# Altium schematic sheet alphanumeric.SchDoc
size A4
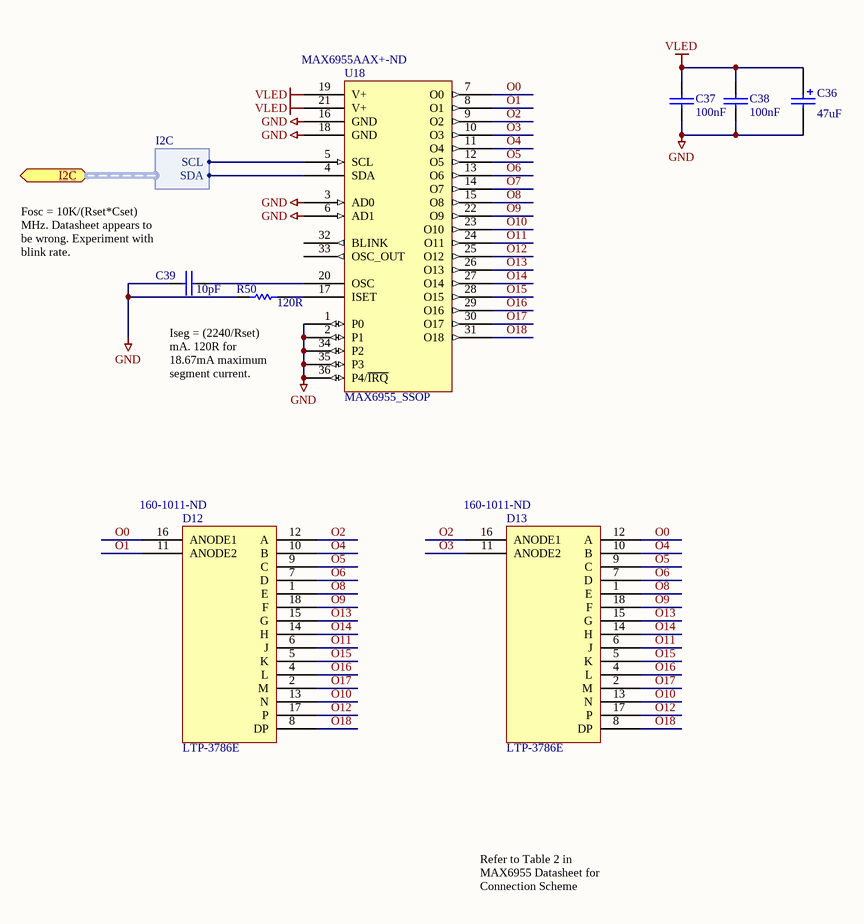
[diagram p0: alphanumeric.SchDoc]

## Parts
C36  value 47uF  [CAPMP7343X19N (Murata D4)]
C37  100nF  [0603]
C38  100nF  [0603]
C39  10pF  [0603]
D12  LTP-3786E  Supplier Part Number 1: 160-1011-ND  [LTP-3786E]
D13  LTP-3786E  Supplier Part Number 1: 160-1011-ND  [LTP-3786E]
R50  120R  [0603]
U18  MAX6955_SSOP  Supplier Part Number 1: MAX6955AAX+-ND  [SOP127P600-8N-36]

## Ports
I2C (harness I2C)

## Harnesses
I2C: SCL, SDA

## Nets
GND: C36.2 C37.1 C38.2 C39.1 R50.2 U18.1(P0) U18.2(P1) U18.3(AD0) U18.6(AD1) U18.16(GND) U18.18(GND) U18.34(P2) U18.35(P3) U18.36(P4/~{IRQ})
VLED: C36.1 C37.2 C38.1 U18.19(V+) U18.21(V+)
O0: D12.16(ANODE1) D13.12(A) U18.7(O0)
O1: D12.11(ANODE2) U18.8(O1)
O2: D12.12(A) D13.16(ANODE1) U18.9(O2)
O3: D13.11(ANODE2) U18.10(O3)
O4: D12.10(B) D13.10(B) U18.11(O4)
O5: D12.9(C) D13.9(C) U18.12(O5)
O6: D12.7(D) D13.7(D) U18.13(O6)
O7: U18.14(O7)
O8: D12.1(E) D13.1(E) U18.15(O8)
O9: D12.18(F) D13.18(F) U18.22(O9)
O10: D12.13(N) D13.13(N) U18.23(O10)
O11: D12.6(J) D13.6(J) U18.24(O11)
O12: D12.17(P) D13.17(P) U18.25(O12)
O13: D12.15(G) D13.15(G) U18.26(O13)
O14: D12.14(H) D13.14(H) U18.27(O14)
O15: D12.5(K) D13.5(K) U18.28(O15)
O16: D12.4(L) D13.4(L) U18.29(O16)
O17: D12.2(M) D13.2(M) U18.30(O17)
O18: D12.8(DP) D13.8(DP) U18.31(O18)
NetC39_2: C39.2 U18.20(OSC)
NetR50_1: R50.1 U18.17(ISET)
NetU18_4: U18.4(SDA) ; port I2C.SDA
NetU18_5: U18.5(SCL) ; port I2C.SCL

Not connected (* = marked no-connect by the designer): U18 32(BLINK) 33(OSC_OUT)

## Notes on the sheet
- (near C39) Fosc = 10K/(Rset*Cset) MHz. Datasheet appears to be wrong. Experiment with blink rate.
- Iseg = (2240/Rset) mA. 120R for 18.67mA maximum segment current.
- Refer to Table 2 in MAX6955 Datasheet for Connection Scheme

## Library data of the parts
C36 = CAP POL3: Polarized Capacitor (Surface Mount); Manufacturer: Generic Components; Manufacturer Part Number: ECASD40J476M025K00; Class I: Passive; Description: CAP ALUM 47UF 6.3V 20% SMD; Capacitance: 47µF; Voltage Rating: 6.3V; Tolerance: ±20%; ESR (Equivalent Series Resistance): 25 mOhm; Lifetime @ Temp.: 1000 Hrs @ 105°C; Type: Polymer; Ripple Current: 1.8A; Surface Mount Land Size: 0.287" L x 0.169" W (7.30mm x 4.30mm); Published: 8-Jun-2000; Revision: July-2002: Re-released for DXP Platform.; Publisher: Altium Limited; Class II: Capacitor; Digikey: 490-5463-1-ND; Supplier 1: Digi-Key; Supplier Part Number 1: 490-5463-1-ND; RoHS: RoHS Compliant; Category: Capacitors; Stock 1: 3903; Pricing 1: 1=2.26, 10=1.848, 50=1.6224, 100=1.307, 250=1.0816, 500=0.96896, 1000=0.85628 (AUD); Packaging: Cut Tape (CT); Operating Temperature: -40°C ~ 105°C; Applications: -; Impedance: -; Lead Spacing: -; Size / Dimension: 0.287" L x 0.169" W (7.30mm x 4.30mm); Height - Seated (Max): 0.075" (1.90mm); Mounting Type: Surface Mount; Package / Case: 2917 (7343 Metric); ComponentLink1URL: http://www.murata.com/products/catalog/pdf/c90e.pdf; ComponentLink1Description: http://www.murata.com/products/catalog/pdf/c90e.pdf
C37 C38 = CAP: Capacitor; Manufacturer: TDK Corporation; Manufacturer Part Number: C1608X7R1H103K080AA; Needed?: NO - HW LAB; Description: CAP CER 10000PF 50V 10% X7R 0603; Capacitance: 10000pF; Voltage - Rated: 50V; Tolerance: ±10%; Temperature Coefficient: X7R; Value: 100nF; Supplier 1: Digi-Key; Supplier Part Number 1: 445-1311-1-ND; RoHS: RoHS Compliant; Category: Capacitors; Stock 1: 569984; Pricing 1: 1=0.14, 10=0.035, 100=0.0159, 250=0.01296, 500=0.0111, 1000=0.00865 (AUD); Packaging: Cut Tape (CT); Mounting Type: Surface Mount, MLCC; Operating Temperature: -55°C ~ 125°C; Applications: General Purpose; Ratings: -; Package / Case: 0603 (1608 Metric); Size / Dimension: 0.063" L x 0.031" W (1.60mm x 0.80mm); Height - Seated (Max): -; Thickness (Max): 0.037" (0.95mm); Lead Spacing: -; Features: -; Lead Style: -; ComponentLink1URL: http://product.tdk.com/capacitor/mlcc/en/documents/mlcc_commercial_general_en.pdf; ComponentLink1Description: http://product.tdk.com/capacitor/mlcc/en/documents/mlcc_commercial_general_en.pdf
C39 = CAP: Capacitor; Manufacturer: TDK Corporation; Manufacturer Part Number: C1608C0G1H100D080AA; Needed?: NO - HW LAB; Description: CAP CER 10PF 50V NP0 0603; Voltage - Rated: 50V; Tolerance: ±0.5pF; Temperature Coefficient: C0G, NP0; Value: 10pF; Supplier 1: Digi-Key; Supplier Part Number 1: 445-1269-1-ND; RoHS: RoHS Compliant; Category: Capacitors; Stock 1: 206915; Pricing 1: 1=0.12, 10=0.043, 100=0.0198, 250=0.01624, 500=0.0139, 1000=0.01082 (AUD); Packaging: Cut Tape (CT); Capacitance: 10pF; Mounting Type: Surface Mount, MLCC; Operating Temperature: -55°C ~ 125°C; Applications: General Purpose; Ratings: -; Package / Case: 0603 (1608 Metric); Size / Dimension: 0.063" L x 0.031" W (1.60mm x 0.80mm); Height - Seated (Max): -; Thickness (Max): 0.037" (0.95mm); Lead Spacing: -; Features: -; Lead Style: -; ComponentLink1URL: http://product.tdk.com/capacitor/mlcc/en/documents/mlcc_commercial_general_en.pdf; ComponentLink1Description: http://product.tdk.com/capacitor/mlcc/en/documents/mlcc_commercial_general_en.pdf
D12 D13 = LTP-3786E: 13.8mm dual digit 14-segment single digit alphanumeric display; Manufacturer: Lite-On Inc; Description: LED ALPHNUM.54" 2DGT RED-ORNG CA; Number of Digits/Alpha: 2; Digit/Alpha Size: 0.54" (13.80mm); Display Type: 14-Segment, Alphanumeric; Common Pin: Common Anode; Color: Orange-Red; Voltage - Forward (Vf) Typ: 2V; Current - Test: 20mA; Millicandela Rating: 2.3mcd; Wavelength - Peak: 630nm; Power Dissipation (Max): 75mW; Supplier 1: Digi-Key; Manufacturer Part Number: LTP-3786E; RoHS: RoHS Compliant; Category: Optoelectronics; Stock 1: 1999; Pricing 1: 1=4.1, 10=3.413, 100=2.457, 250=2.184, 500=1.97926, 1000=1.82 (AUD); Size / Dimension: 0.833" H x 0.992" W x 0.307" D (21.15mm x 25.20mm x 7.80mm); Package / Case: 18-DIP; ComponentLink1URL: http://media.digikey.com/pdf/Data%20Sheets/Lite-On%20PDFs/LTP-3786E.pdf; ComponentLink1Description: http://media.digikey.com/pdf/Data%20Sheets/Lite-On%20PDFs/LTP-3786E.pdf
R50 = Res Semi: Semiconductor Resistor; Manufacturer: Panasonic Electronic Components; Manufacturer Part Number: ERJ-3EKF1200V; Value: 1K; Description: RES 120 OHM 1/10W 1% 0603 SMD; Resistance (Ohms): 120; Power (Watts): 0.1W, 1/10W; Temperature Coefficient: ±100ppm/°C; Tolerance: ±1%; Published: 8-Jun-2000; LatestRevisionDate: 17-Jul-2002; LatestRevisionNote: Re-released for DXP Platform.; PackageReference: AXIAL-0.5; Publisher: Altium Limited; PackageDescription: Axial Device, Thru-Hole; 2 Leads; 0.5 in Pin Spacing; Supplier 1: Digi-Key; Supplier Part Number 1: P120HCT-ND; RoHS: RoHS Compliant; Category: Resistors; Stock 1: 359464; Pricing 1: 1=0.12, 50=0.0166, 100=0.0126, 250=0.00936, 500=0.00692, 1000=0.00461 (AUD); Packaging: Cut Tape (CT); Composition: Thick Film; Features: -; Package / Case: 0603 (1608 Metric); Supplier Device Package: 0603; Size / Dimension: 0.063" L x 0.031" W (1.60mm x 0.80mm); Height: 0.022" (0.55mm); Number of Terminations: 2; ComponentLink1URL: http://industrial.panasonic.com/www-cgi/jvcr13pz.cgi?E+PZ+3+AOA0002+ERJ3EKF1200V+7+WW; ComponentLink1Description: http://industrial.panasonic.com/www-cgi/jvcr13pz.cgi?E+PZ+3+AOA0002+ERJ3EKF1200V+7+WW
U18 = MAX6955_SSOP: 2-Wire Interfaced, 2.7V to 5.5V LED Display Driver; Manufacturer: Maxim Integrated; Manufacturer Part Number: MAX6955AAX+; Description: IC DRIVER LED SEG 14/16 36-SSOP; Configuration: 7, 14, 16 Segment; Interface: I²C; Current - Supply: 22mA; Voltage - Supply: 2.7 V ~ 5.5 V; Supplier 1: Digi-Key; RoHS: RoHS Compliant; Category: Integrated Circuits (ICs); Stock 1: 500; Pricing 1: 1=27.92, 25=19.5888, 100=14.1951, 500=12.48788 (AUD); Packaging: Tube; Display Type: LED; Digits or Characters: -; Operating Temperature: -40°C ~ 125°C; Mounting Type: Surface Mount; Package / Case: 36-BSOP (0.295", 7.50mm Width); Supplier Device Package: 36-SSOP; ComponentLink1URL: http://datasheets.maximintegrated.com/en/ds/MAX6955.pdf; ComponentLink1Description: http://datasheets.maximintegrated.com/en/ds/MAX6955.pdf